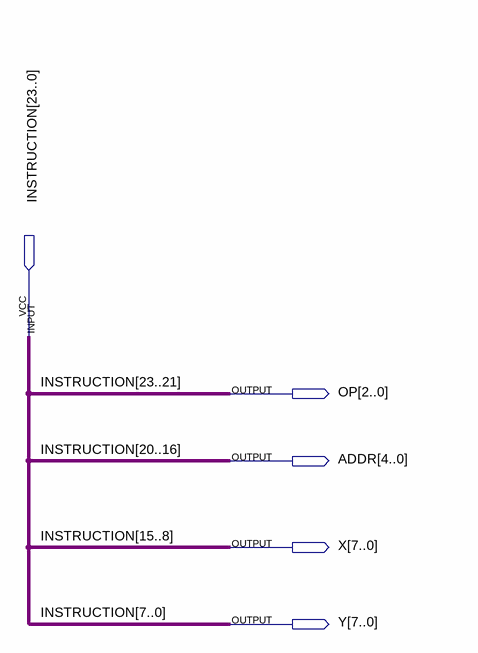
[diagram p0: schematic sheet]
// Quartus schematic Decoder.bdf as structural Verilog: 0 symbols, 5 pins
module Decoder (
  input  [23:0] INSTRUCTION,
  output [2:0] OP,
  output [4:0] ADDR,
  output [7:0] X,
  output [7:0] Y
);


  assign ADDR = INSTRUCTION[20:16];
  assign OP = INSTRUCTION[23:21];
  assign X = INSTRUCTION[15:8];
  assign Y = INSTRUCTION[7:0];
endmodule
